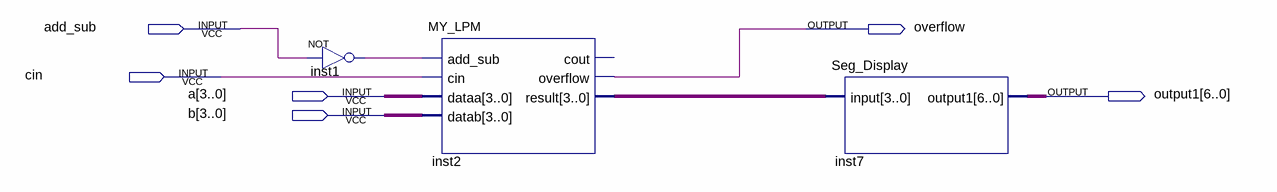
[diagram p0: schematic sheet]
// Quartus schematic LPM_Block1.bdf as structural Verilog: 3 symbols, 6 pins
module LPM_Block1 (
  input  add_sub,
  input  cin,
  input  [3:0] a,
  input  [3:0] b,
  output overflow,
  output [6:0] output1
);

  wire inst1_out;
  wire [3:0] inst2_result;

  not inst1 (inst1_out, add_sub);
  MY_LPM inst2 (
    .add_sub(inst1_out), .cin(cin), .dataa(a), .datab(b), .overflow(overflow), .result(inst2_result));  // open: cout
  Seg_Display inst7 (.\input (inst2_result), .output1(output1));
endmodule
